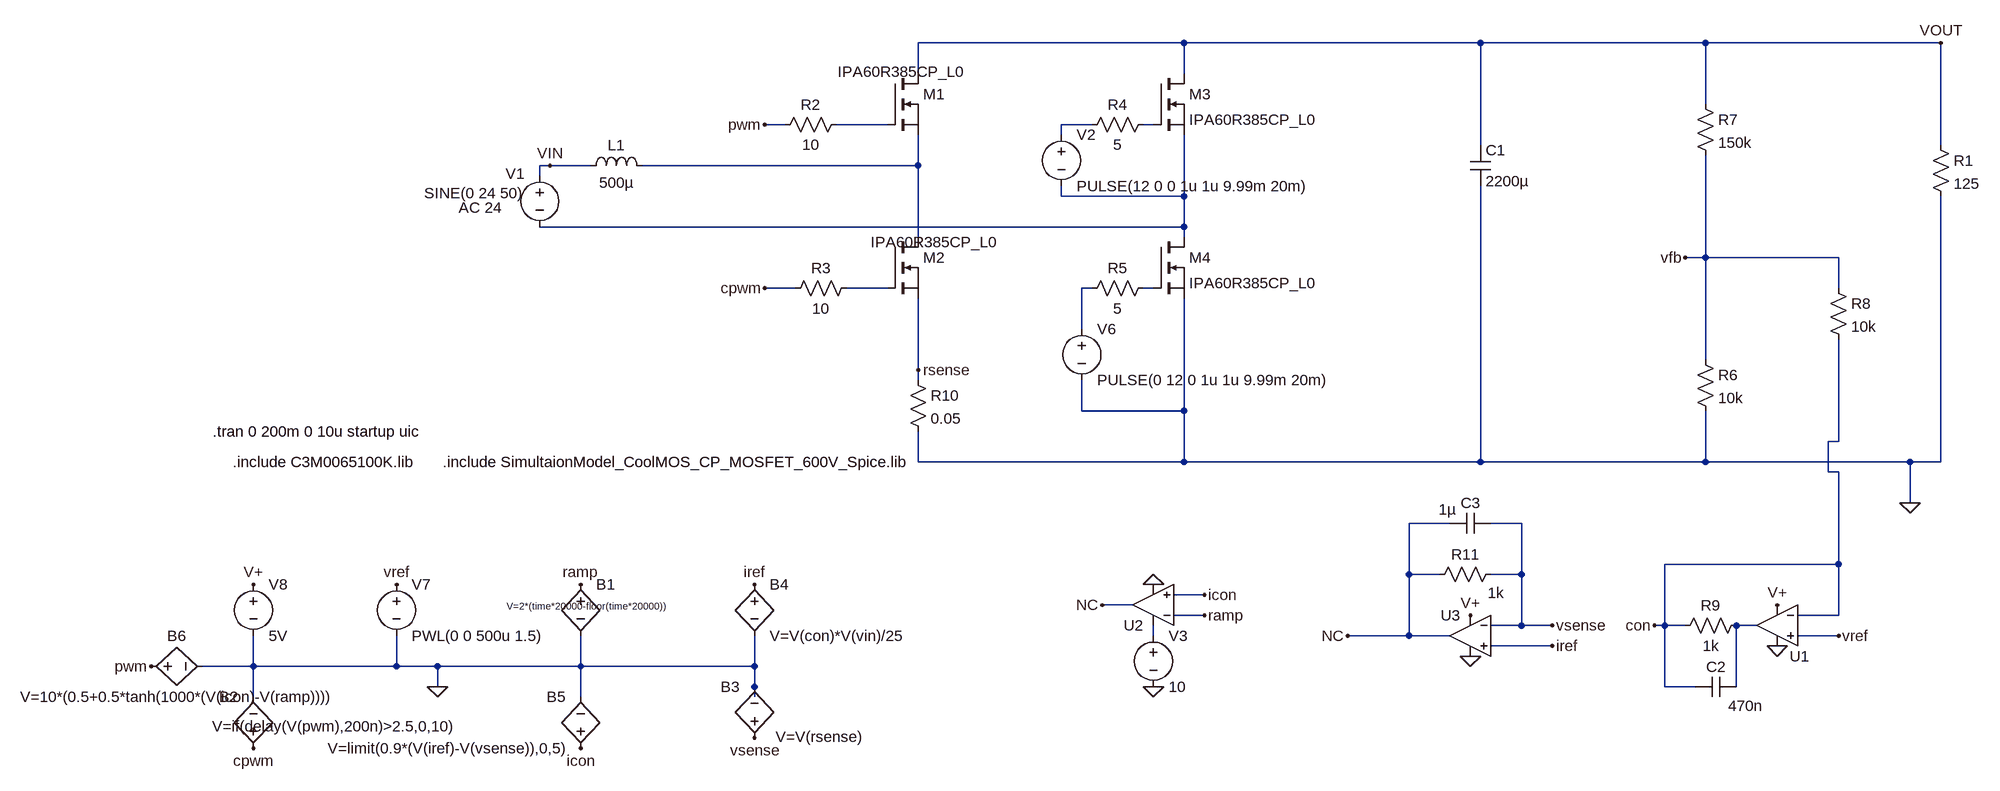
[diagram p0: schematic totempfc.asc]
totempfc.asc, the LTspice schematic file:
Version 4.1
SHEET 1 2900 1228
WIRE 816 -112 400 -112
WIRE 1280 -112 816 -112
WIRE 1632 -112 1280 -112
WIRE 2000 -112 1632 -112
WIRE 400 -64 400 -112
WIRE 816 -64 816 -112
WIRE 1632 -16 1632 -112
WIRE 192 16 160 16
WIRE 352 16 272 16
WIRE 672 16 624 16
WIRE 768 16 752 16
WIRE 624 32 624 16
WIRE 1280 48 1280 -112
WIRE 2000 48 2000 -112
WIRE -176 80 -192 80
WIRE -112 80 -176 80
WIRE 400 80 400 32
WIRE 400 80 -32 80
WIRE -192 96 -192 80
WIRE 624 128 624 112
WIRE 816 128 816 32
WIRE 816 128 624 128
WIRE 816 176 816 128
WIRE 816 176 -192 176
WIRE 400 192 400 80
WIRE 816 192 816 176
WIRE 1632 224 1632 64
WIRE 1632 224 1600 224
WIRE 1840 224 1632 224
WIRE 208 272 160 272
WIRE 352 272 288 272
WIRE 672 272 656 272
WIRE 768 272 752 272
WIRE 1840 272 1840 224
WIRE 656 336 656 272
WIRE 1632 384 1632 224
WIRE 400 400 400 288
WIRE 400 416 400 400
WIRE 656 464 656 416
WIRE 816 464 816 288
WIRE 816 464 656 464
WIRE 1840 512 1840 352
WIRE 1840 512 1824 512
WIRE 400 544 400 496
WIRE 816 544 816 464
WIRE 816 544 400 544
WIRE 1280 544 1280 112
WIRE 1280 544 816 544
WIRE 1632 544 1632 464
WIRE 1632 544 1280 544
WIRE 1952 544 1632 544
WIRE 2000 544 2000 128
WIRE 2000 544 1952 544
WIRE 1824 560 1824 512
WIRE 1840 560 1824 560
WIRE 1952 608 1952 544
WIRE 1232 640 1168 640
WIRE 1344 640 1296 640
WIRE 1840 704 1840 560
WIRE 1840 704 1568 704
WIRE 1168 720 1168 640
WIRE 1216 720 1168 720
WIRE 1344 720 1344 640
WIRE 1344 720 1296 720
WIRE 848 752 800 752
WIRE 736 768 688 768
WIRE 848 784 800 784
WIRE 1840 784 1840 704
WIRE 1840 784 1776 784
WIRE 1344 800 1344 720
WIRE 1344 800 1296 800
WIRE 1392 800 1344 800
WIRE 1568 800 1568 704
WIRE 1568 800 1552 800
WIRE 1600 800 1568 800
WIRE 1712 800 1680 800
WIRE 768 816 768 800
WIRE 1168 816 1168 720
WIRE 1168 816 1072 816
WIRE 1232 816 1168 816
WIRE 1840 816 1776 816
WIRE 1392 832 1296 832
WIRE -640 864 -640 816
WIRE -640 864 -720 864
WIRE -416 864 -416 816
WIRE -416 864 -640 864
WIRE -352 864 -416 864
WIRE -128 864 -128 816
WIRE -128 864 -352 864
WIRE 144 864 144 816
WIRE 144 864 -128 864
WIRE -352 896 -352 864
WIRE 144 896 144 864
WIRE 1568 896 1568 800
WIRE 1616 896 1568 896
WIRE 1680 896 1680 800
WIRE -640 912 -640 864
WIRE -128 912 -128 864
WIRE 144 912 144 896
FLAG 1952 608 0
FLAG 2000 -112 VOUT
FLAG -176 80 VIN
FLAG 1600 224 vfb
FLAG 1744 832 0
FLAG -352 896 0
FLAG -640 736 V+
FLAG -416 736 vref
FLAG -128 736 ramp
FLAG 1744 768 V+
FLAG 1840 816 vref
FLAG 768 736 0
FLAG 1552 800 con
FLAG 848 752 icon
FLAG 848 784 ramp
FLAG 160 16 pwm
FLAG -640 992 cpwm
FLAG -800 864 pwm
FLAG 1264 784 V+
FLAG 1264 848 0
FLAG 400 400 rsense
FLAG 144 736 iref
FLAG 1392 832 iref
FLAG 1392 800 vsense
FLAG -128 992 icon
FLAG 768 896 0
FLAG 144 976 vsense
FLAG 160 272 cpwm
FLAG 688 768 NC
FLAG 1072 816 NC
SYMBOL voltage -192 80 R0
WINDOW 0 -53 13 Left 2
WINDOW 3 -181 43 Left 2
WINDOW 123 -127 66 Left 2
WINDOW 39 0 0 Left 0
SYMATTR InstName V1
SYMATTR Value SINE(0 24 50)
SYMATTR Value2 AC 24
SYMBOL nmos 352 192 R0
WINDOW 3 -26 8 Left 2
SYMATTR Value IPA60R385CP_L0
SYMATTR InstName M2
SYMATTR Prefix X
SYMBOL cap 1264 48 R0
SYMATTR InstName C1
SYMATTR Value 2200µ
SYMBOL res 1984 32 R0
SYMATTR InstName R1
SYMATTR Value 125
SYMBOL nmos 768 -64 R0
SYMATTR InstName M3
SYMATTR Value IPA60R385CP_L0
SYMATTR Prefix X
SYMBOL nmos 768 192 R0
SYMATTR InstName M4
SYMATTR Value IPA60R385CP_L0
SYMATTR Prefix X
SYMBOL nmos 352 -64 R0
WINDOW 3 -78 -3 Left 2
SYMATTR Value IPA60R385CP_L0
SYMATTR InstName M1
SYMATTR Prefix X
SYMBOL voltage 624 16 R0
WINDOW 123 0 0 Left 0
WINDOW 39 0 0 Left 0
SYMATTR InstName V2
SYMATTR Value PULSE(12 0 0 1u 1u 9.99m 20m)
SYMBOL ind -128 96 R270
WINDOW 0 32 56 VTop 2
WINDOW 3 5 56 VBottom 2
SYMATTR InstName L1
SYMATTR Value 500µ
SYMATTR SpiceLine Rser=0.1
SYMBOL res 288 0 R90
WINDOW 0 0 56 VBottom 2
WINDOW 3 32 56 VTop 2
SYMATTR InstName R2
SYMATTR Value 10
SYMBOL res 304 256 R90
WINDOW 0 0 56 VBottom 2
WINDOW 3 32 56 VTop 2
SYMATTR InstName R3
SYMATTR Value 10
SYMBOL res 768 0 R90
WINDOW 0 0 56 VBottom 2
WINDOW 3 32 56 VTop 2
SYMATTR InstName R4
SYMATTR Value 5
SYMBOL voltage 656 320 R0
WINDOW 123 0 0 Left 0
WINDOW 39 0 0 Left 0
SYMATTR InstName V6
SYMATTR Value PULSE(0 12 0 1u 1u 9.99m 20m)
SYMBOL res 768 256 R90
WINDOW 0 0 56 VBottom 2
WINDOW 3 32 56 VTop 2
SYMATTR InstName R5
SYMATTR Value 5
SYMBOL res 1616 -32 R0
SYMATTR InstName R7
SYMATTR Value 150k
SYMBOL res 1616 368 R0
SYMATTR InstName R6
SYMATTR Value 10k
SYMBOL OpAmps\\UniversalOpAmp2 1744 800 M0
WINDOW 0 -50 48 Left 2
SYMATTR InstName U1
SYMBOL voltage -416 720 R0
WINDOW 123 0 0 Left 0
WINDOW 39 0 0 Left 0
SYMATTR InstName V7
SYMATTR Value PWL(0 0 500u 1.5)
SYMBOL voltage -640 720 R0
WINDOW 123 0 0 Left 0
WINDOW 39 0 0 Left 0
SYMATTR InstName V8
SYMATTR Value 5V
SYMBOL bv -128 720 R0
WINDOW 3 -116 50 Left 1
SYMATTR Value V=2*(time*20000-floor(time*20000))
SYMATTR InstName B1
SYMBOL OpAmps\\UniversalOpAmp2 768 768 R180
SYMATTR InstName U2
SYMBOL cap 1680 880 R90
WINDOW 0 0 32 VBottom 2
WINDOW 3 30 -14 VTop 2
SYMATTR InstName C2
SYMATTR Value 470n
SYMBOL bv -640 1008 R180
WINDOW 0 24 96 Left 2
WINDOW 3 -314 50 Left 2
SYMATTR InstName B2
SYMATTR Value V=if(delay(V(pwm),200n)>2.5,0,10)
SYMBOL res 1824 256 R0
SYMATTR InstName R8
SYMATTR Value 10k
SYMBOL res 1696 784 R90
WINDOW 0 0 56 VBottom 2
WINDOW 3 32 56 VTop 2
SYMATTR InstName R9
SYMATTR Value 1k
SYMBOL res 384 400 R0
SYMATTR InstName R10
SYMATTR Value 0.05
SYMBOL OpAmps\\UniversalOpAmp2 1264 816 M0
SYMATTR InstName U3
SYMBOL res 1312 704 R90
WINDOW 0 0 56 VBottom 2
WINDOW 3 29 8 VTop 2
SYMATTR InstName R11
SYMATTR Value 1k
SYMBOL cap 1296 624 R90
WINDOW 0 0 32 VBottom 2
WINDOW 3 -21 68 VTop 2
SYMATTR InstName C3
SYMATTR Value 1µ
SYMBOL bv 144 720 R0
SYMATTR InstName B4
SYMATTR Value V=V(con)*V(vin)/25
SYMBOL voltage 768 800 R0
WINDOW 123 0 0 Left 0
WINDOW 39 0 0 Left 0
SYMATTR InstName V3
SYMATTR Value 10
SYMBOL bv 144 992 R180
WINDOW 0 24 96 Left 2
WINDOW 3 -168 18 Left 2
SYMATTR InstName B3
SYMATTR Value V=V(rsense)
SYMBOL bv -128 1008 R180
WINDOW 0 24 96 Left 2
WINDOW 3 24 16 Left 2
SYMATTR InstName B5
SYMATTR Value V=limit(0.9*(V(iref)-V(vsense)),0,5)
SYMBOL bv -816 864 R270
WINDOW 0 32 56 VTop 2
WINDOW 3 -32 56 VBottom 2
SYMATTR InstName B6
SYMATTR Value V=10*(0.5+0.5*tanh(1000*(V(icon)-V(ramp))))
TEXT -672 544 Left 2 !.include C3M0065100K.lib
TEXT -344 544 Left 2 !.include SimultaionModel_CoolMOS_CP_MOSFET_600V_Spice.lib
TEXT -704 496 Left 2 !.tran 0 200m 0 10u startup uic

The netlist it stands for:
* totempfc.asc
V1 VIN N005 SINE(0 24 50) AC 24
X§M2 N004 N006 rsense IPA60R385CP_L0  ; pins D G S
C1 VOUT 0 2200µ
R1 VOUT 0 125
X§M3 VOUT N003 N005 IPA60R385CP_L0  ; pins D G S
X§M4 N005 N008 0 IPA60R385CP_L0  ; pins D G S
X§M1 VOUT N001 N004 IPA60R385CP_L0  ; pins D G S
V2 N002 N005 PULSE(12 0 0 1u 1u 9.99m 20m)
L1 VIN N004 500µ Rser=0.1
R2 N001 pwm 10
R3 N006 cpwm 10
R4 N003 N002 5
V6 N007 0 PULSE(0 12 0 1u 1u 9.99m 20m)
R5 N008 N007 5
R7 VOUT vfb 150k
R6 vfb 0 10k
X§U1 vref con V+ 0 N009 level2 Avol=1Meg GBW=10Meg Slew=10Meg Ilimit=25m Rail=0 Vos=0 En=0 Enk=0 In=0 Ink=0 Rin=500Meg  ; pins In+ In- V+ V- OUT
V7 vref 0 PWL(0 0 500u 1.5)
V8 V+ 0 5V
B1 ramp 0 V=2*(time*20000-floor(time*20000))
X§U2 icon ramp N010 0 NC level2 Avol=1Meg GBW=10Meg Slew=10Meg Ilimit=25m Rail=0 Vos=0 En=0 Enk=0 In=0 Ink=0 Rin=500Meg  ; pins In+ In- V+ V- OUT
C2 N009 con 470n
B2 cpwm 0 V=if(delay(V(pwm),200n)>2.5,0,10)
R8 vfb con 10k
R9 N009 con 1k
R10 rsense 0 0.05
X§U3 iref vsense V+ 0 NC level2 Avol=1Meg GBW=10Meg Slew=10Meg Ilimit=25m Rail=0 Vos=0 En=0 Enk=0 In=0 Ink=0 Rin=500Meg  ; pins In+ In- V+ V- OUT
R11 vsense NC 1k
C3 vsense NC 1µ
B4 iref 0 V=V(con)*V(vin)/25
V3 N010 0 10
B3 vsense 0 V=V(rsense)
B5 icon 0 V=limit(0.9*(V(iref)-V(vsense)),0,5)
B6 pwm 0 V=10*(0.5+0.5*tanh(1000*(V(icon)-V(ramp))))
.include C3M0065100K.lib
.include SimultaionModel_CoolMOS_CP_MOSFET_600V_Spice.lib
.tran 0 200m 0 10u startup uic
.lib UniversalOpAmp2.lib
.backanno
.end